# Altium schematic sheet Sensor_module_uCMotionBoard.SchDoc
size A4
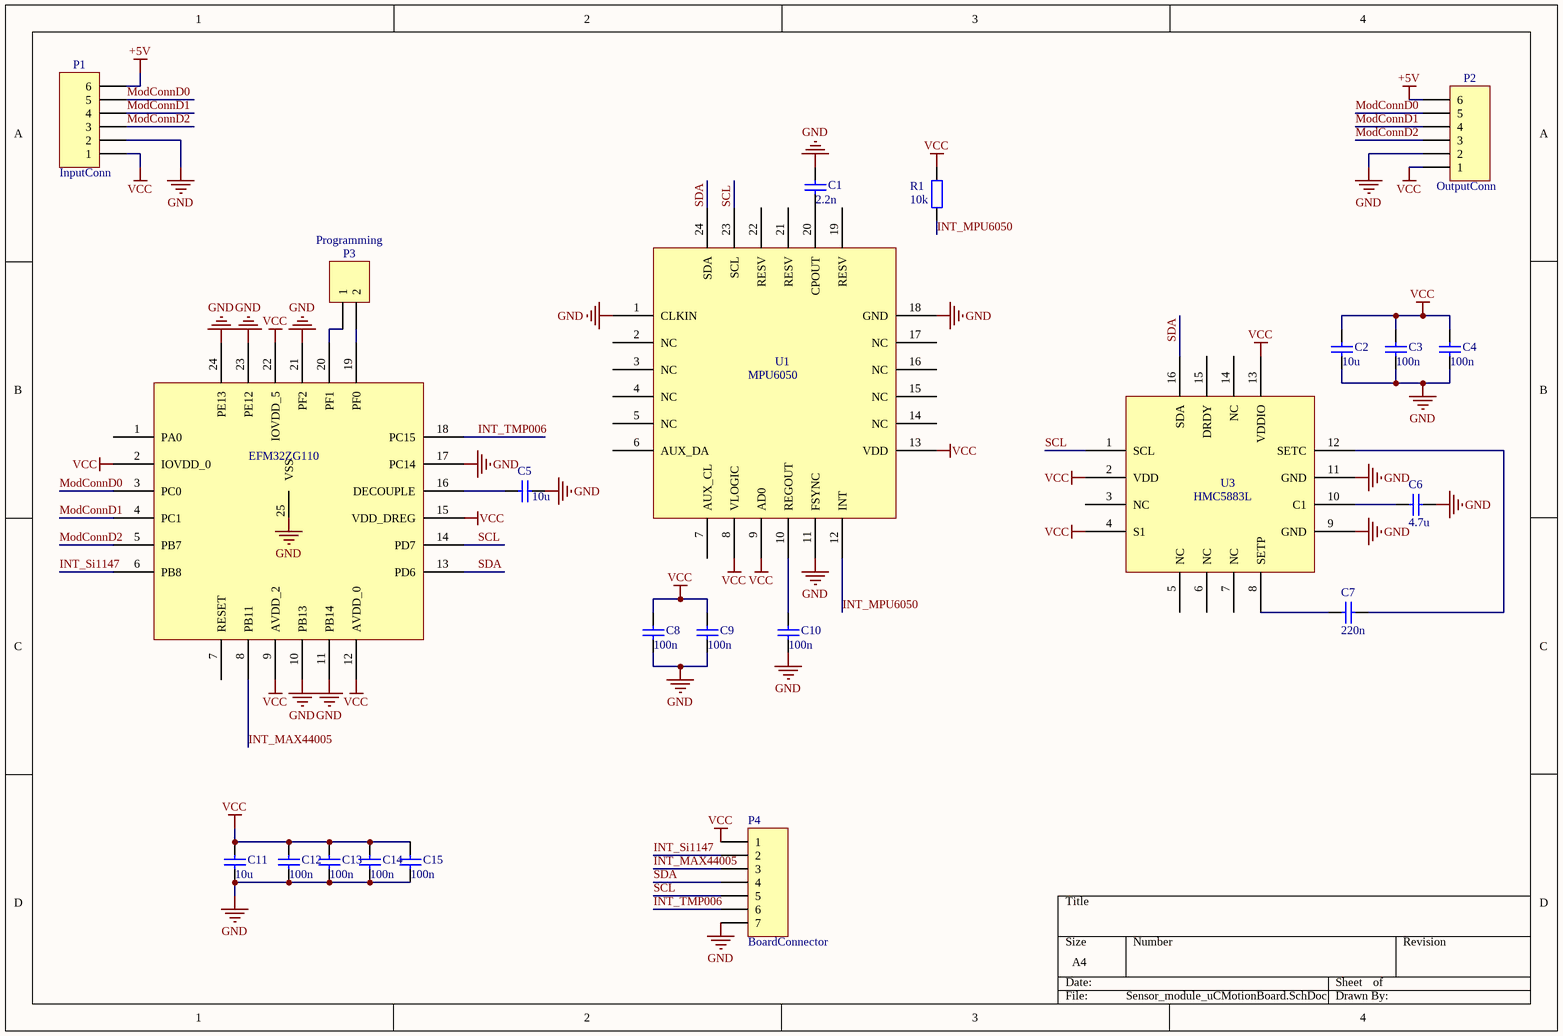
[diagram p0: Sensor_module_uCMotionBoard.SchDoc]

## Parts
C1  value 2.2n  [1608[0603]]  (hidden comment: Cap Semi)
C2  10u  [0805]
C3  value 100n  [0402]  (hidden comment: Cap Semi)
C4  value 100n  [0402]  (hidden comment: Cap Semi)
C5  10u  [0805]
C6  value 4.7u  [0805]  (hidden comment: 10u)
C7  value 220n  [1608[0603]]  (hidden comment: Cap Semi)
C8  value 100n  [0402]  (hidden comment: Cap Semi)
C9  value 100n  [0402]  (hidden comment: Cap Semi)
C10  value 100n  [0402]  (hidden comment: Cap Semi)
C11  10u  [0805]
C12  value 100n  [0402]  (hidden comment: Cap Semi)
C13  value 100n  [0402]  (hidden comment: Cap Semi)
C14  value 100n  [0402]  (hidden comment: Cap Semi)
C15  value 100n  [0402]  (hidden comment: Cap Semi)
P1  InputConn  [Goldpin6_1.27mm]
P2  OutputConn  [Goldpin6_1.27mm]
P3  Programming  [GeckoProgramming]
P4  BoardConnector  [7pin_sensorBoard_connector_]
R1  value 10k  [0402]  (hidden comment: Res2)
U1  MPU6050  [QFN24_4x4]
U2  EFM32ZG110  [QFN24_5x5_0.65]
U3  HMC5883L  [QFN16_3x3x0.5_noPad]

## Nets
+5V: P1.6 P2.6
GND: C1.2 C2.1 C3.1 C4.1 C5.1 C6.1 C8.1 C9.1 C10.1 C11.1 C12.1 C13.1 C14.1 C15.1 P1.2 P2.2 P4.7 U1.1(CLKIN) U1.11(FSYNC) U1.18(GND) U2.10(PB13) U2.11(PB14) U2.17(PC14) U2.21(PF2) U2.23(PE12) U2.24(PE13) U2.25(VSS) U3.9(GND) U3.11(GND)
VCC: C2.2 C3.2 C4.2 C8.2 C9.2 C11.2 C12.2 C13.2 C14.2 C15.2 P1.1 P2.1 P4.1 R1.2 U1.8(VLOGIC) U1.9(AD0) U1.13(VDD) U2.2(IOVDD_0) U2.9(AVDD_2) U2.12(AVDD_0) U2.15(VDD_DREG) U2.22(IOVDD_5) U3.2(VDD) U3.4(S1) U3.13(VDDIO)
INT_MAX44005: P4.3 U2.8(PB11)
INT_MPU6050: R1.1 U1.12(INT)
INT_Si1147: P4.2 U2.6(PB8)
INT_TMP006: P4.6 U2.18(PC15)
ModConnD0: P1.5 P2.5 U2.3(PC0)
ModConnD1: P1.4 P2.4 U2.4(PC1)
ModConnD2: P1.3 P2.3 U2.5(PB7)
SCL: P4.5 U1.23(SCL) U2.14(PD7) U3.1(SCL)
SDA: P4.4 U1.24(SDA) U2.13(PD6) U3.16(SDA)
NetC1_1: C1.1 U1.20(CPOUT)
NetC5_2: C5.2 U2.16(DECOUPLE)
NetC6_2: C6.2 U3.10(C1)
NetC7_1: C7.1 U3.12(SETC)
NetC7_2: C7.2 U3.8(SETP)
NetC10_2: C10.2 U1.10(REGOUT)
NetP3_1: P3.1 U2.20(PF1)
NetP3_2: P3.2 U2.19(PF0)

Not connected (* = marked no-connect by the designer): U1 2(NC) 3(NC) 4(NC) 5(NC) 6(AUX_DA) 7(AUX_CL) 14(NC) 15(NC) 16(NC) 17(NC) 19(RESV) 21(RESV) 22(RESV); U2 1(PA0) 7(RESET); U3 3(NC) 5(NC) 6(NC) 7(NC) 14(NC) 15(DRDY)

## Library data of the parts
C1-C15 = Cap Semi: Capacitor (Semiconductor SIM Model); Published: 8-Jun-2000; LatestRevisionDate: 29-May-2009; LatestRevisionNote: IPC-7351 Footprint Added.; PackageReference: C1206; Publisher: Altium Limited; PackageDescription: Chip Capacitor
  C2 C5 C11: Value: 10u
P1 P2 = MHDR1X6: Header, 6-Pin; LatestRevisionDate: 17-Jul-2002; LatestRevisionNote: Re-released for DXP Platform.; Publisher: Altium Limited
P3 = MHDR1X2: Header, 2-Pin; LatestRevisionDate: 17-Jul-2002; LatestRevisionNote: Re-released for DXP Platform.; Publisher: Altium Limited
P4 = Header 7: Header, 7-Pin; LatestRevisionDate: 17-Jul-2002; LatestRevisionNote: Re-released for DXP Platform.; Publisher: Altium Limited
R1 = Res2: Resistor; Published: 8-Jun-2000; LatestRevisionDate: 17-Jul-2002; LatestRevisionNote: Re-released for DXP Platform.; PackageReference: AXIAL-0.4; Publisher: Altium Limited; PackageDescription: Axial Device, Thru-Hole; 2 Leads; 0.4 in Pin Spacing